# Altium schematic sheet Modem GNSS.SchDoc
size A2
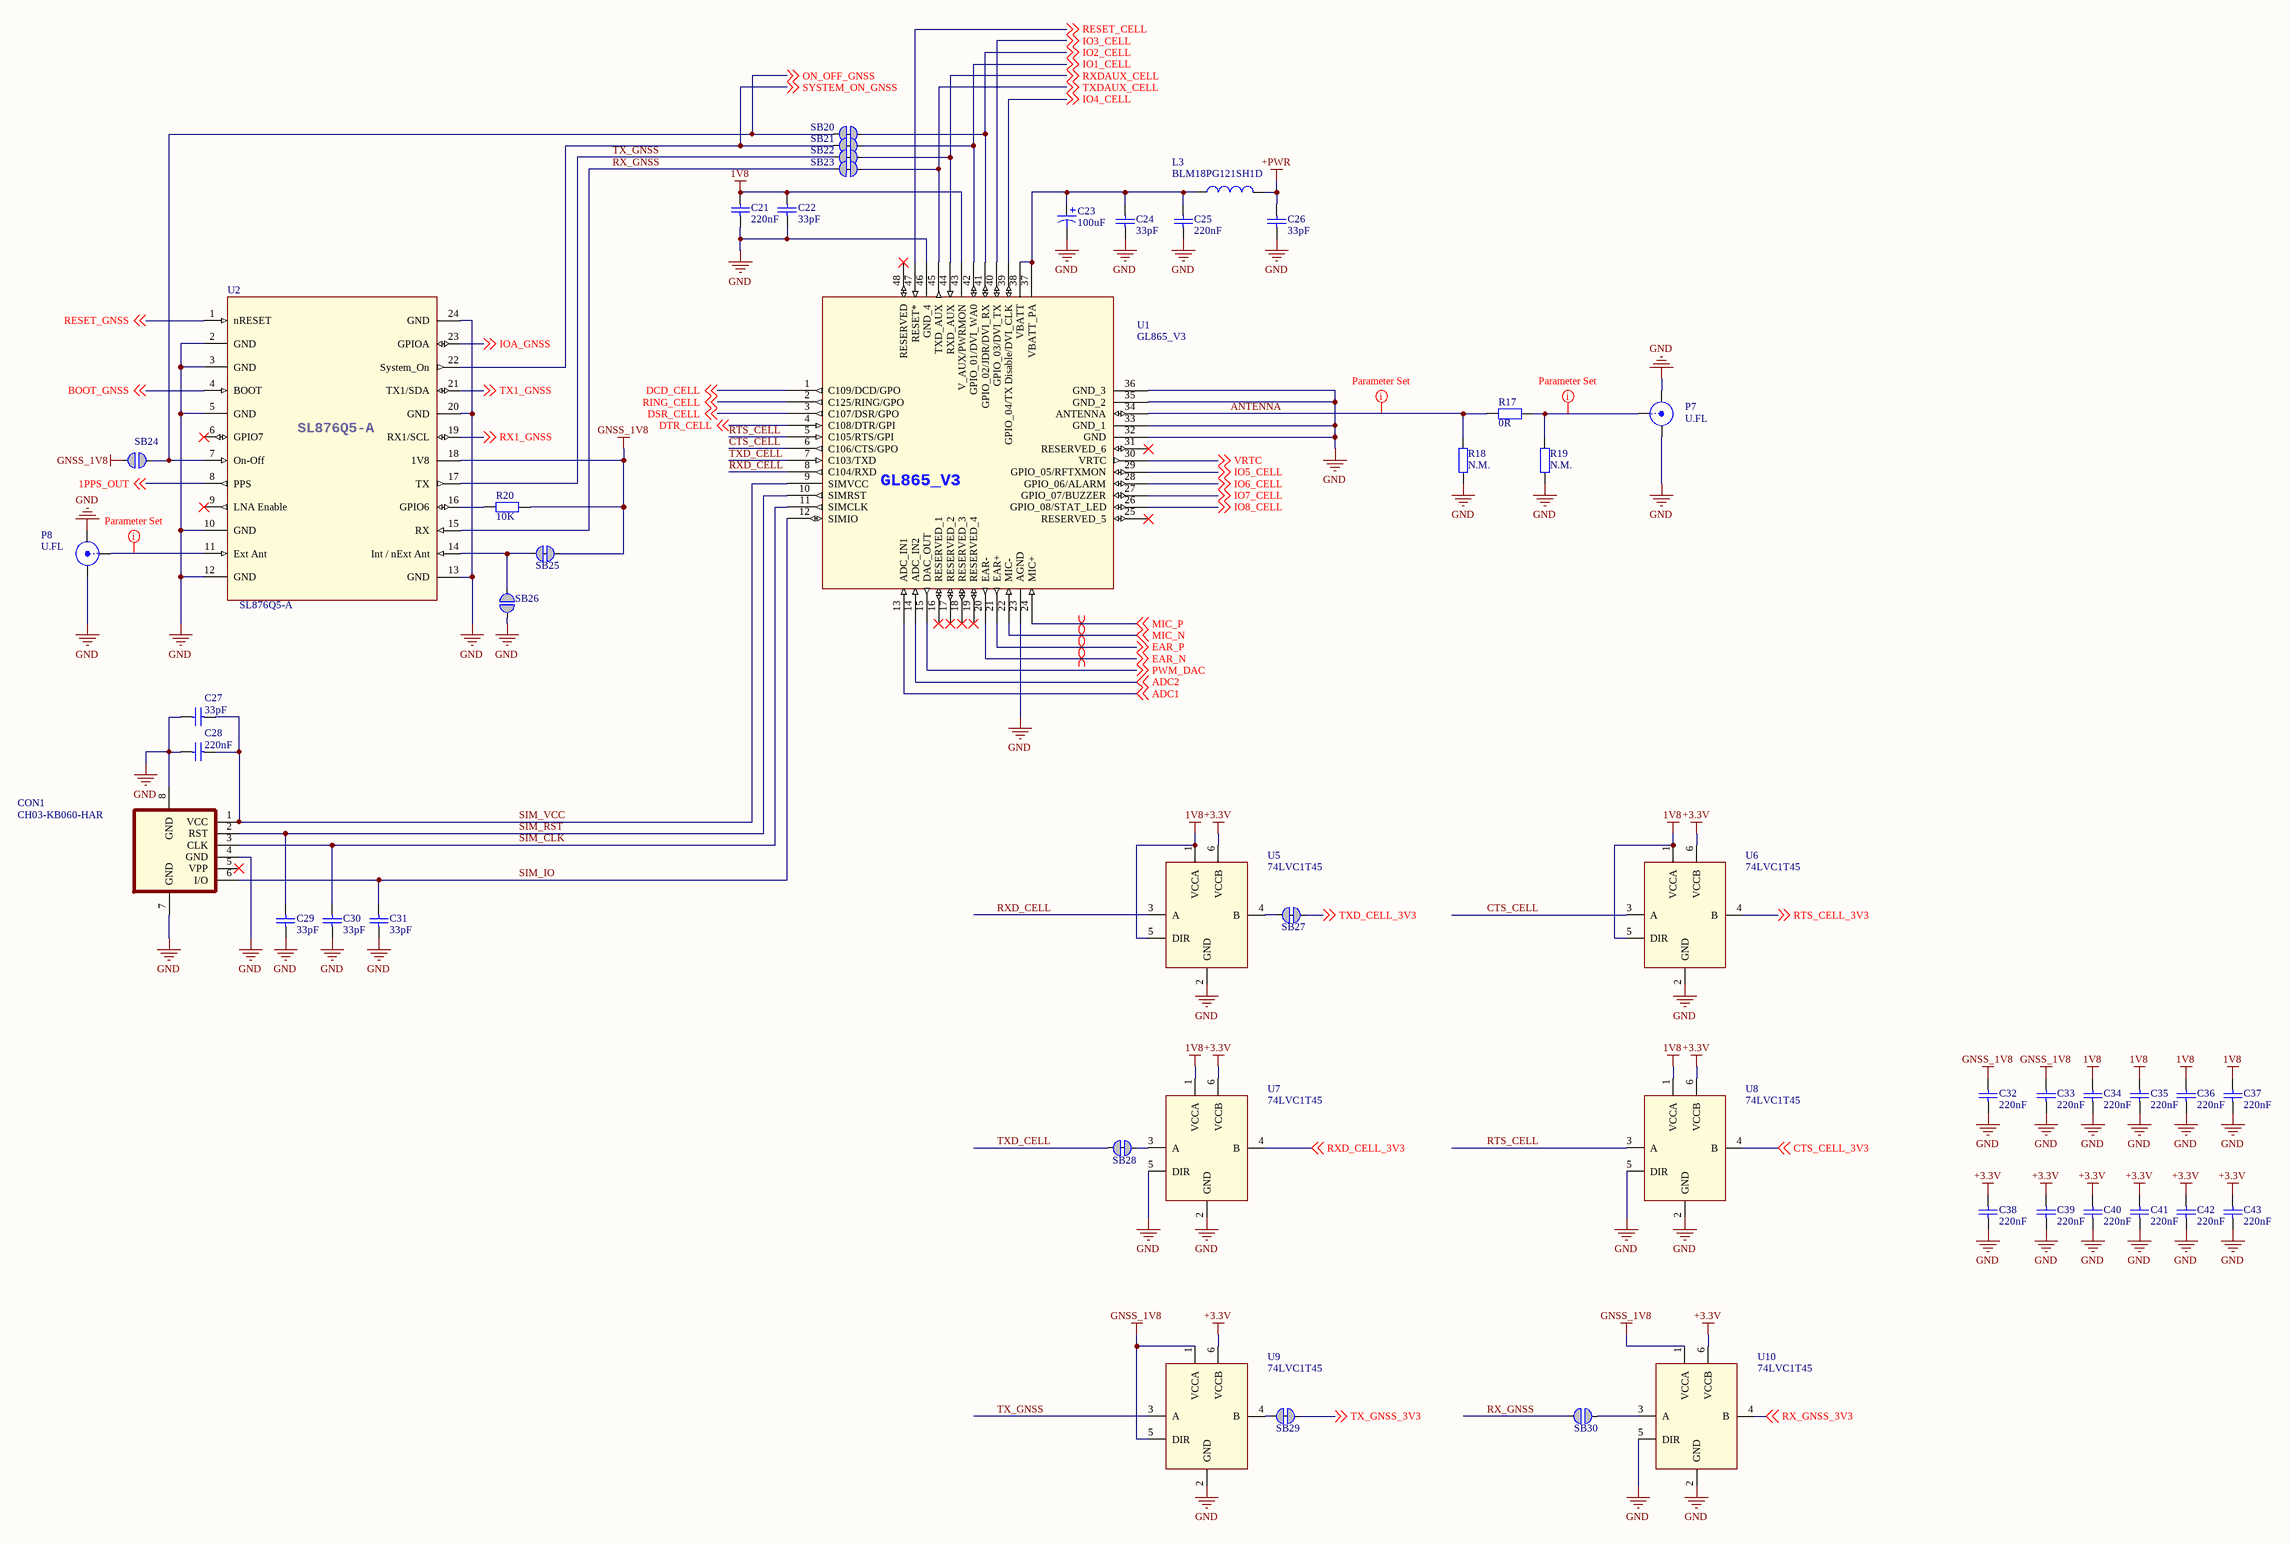
[diagram p0: Modem GNSS.SchDoc]

## Parts
C21  value 220nF  [C0402]  (hidden comment: Cap Semi)
C22  value 33pF  [C0402]  (hidden comment: Cap Semi)
C23  value 100uF  [Case-B]  (hidden comment: electrolytic capacitor)
C24  value 33pF  [C0402]  (hidden comment: Cap Semi)
C25  value 220nF  [C0402]  (hidden comment: Cap Semi)
C26  value 33pF  [C0402]  (hidden comment: Cap Semi)
C27  value 33pF  [C0402]  (hidden comment: Cap Semi)
C28  value 220nF  [C0402]  (hidden comment: Cap Semi)
C29  value 33pF  [C0402]  (hidden comment: Cap Semi)
C30  value 33pF  [C0402]  (hidden comment: Cap Semi)
C31  value 33pF  [C0402]  (hidden comment: Cap Semi)
C32  value 220nF  [C0402]  (hidden comment: Cap Semi)
C33  value 220nF  [C0402]  (hidden comment: Cap Semi)
C34  value 220nF  [C0402]  (hidden comment: Cap Semi)
C35  value 220nF  [C0402]  (hidden comment: Cap Semi)
C36  value 220nF  [C0402]  (hidden comment: Cap Semi)
C37  value 220nF  [C0402]  (hidden comment: Cap Semi)
C38  value 220nF  [C0402]  (hidden comment: Cap Semi)
C39  value 220nF  [C0402]  (hidden comment: Cap Semi)
C40  value 220nF  [C0402]  (hidden comment: Cap Semi)
C41  value 220nF  [C0402]  (hidden comment: Cap Semi)
C42  value 220nF  [C0402]  (hidden comment: Cap Semi)
C43  value 220nF  [C0402]  (hidden comment: Cap Semi)
CON1  CH03-KB060-HAR  [CH03-KB]
L3  value BLM18PG121SH1D  [L0603]  (hidden comment: Inductor)
P7  U.FL  [U.FL_Connector_Male]
P8  U.FL  [U.FL_Connector_Male]
R17  value 0R  [R0402]  (hidden comment: Res2)
R18  value N.M.  [R0402]  (hidden comment: Res2)  (no BOM)
R19  value N.M.  [R0402]  (hidden comment: Res2)  (no BOM)
R20  value 10K  [R0402]  (hidden comment: Res2)
SB20  Solderbridge  [Solderbridge_Shorted]  (value not drawn)  (net tie, no BOM)
SB21  Solderbridge  [Solderbridge_Shorted]  (value not drawn)  (net tie, no BOM)
SB22  Solderbridge  [Solderbridge_Shorted]  (value not drawn)  (net tie, no BOM)
SB23  Solderbridge  [Solderbridge_Shorted]  (value not drawn)  (net tie, no BOM)
SB24  Solderbridge  [Solderbridge]  (value not drawn)  (no BOM)
SB25  Solderbridge  [Solderbridge_Shorted]  (value not drawn)  (net tie, no BOM)
SB26  Solderbridge  [Solderbridge]  (value not drawn)  (no BOM)
SB27  Solderbridge  [Solderbridge_Shorted]  (value not drawn)  (net tie, no BOM)
SB28  Solderbridge  [Solderbridge_Shorted]  (value not drawn)  (net tie, no BOM)
SB29  Solderbridge  [Solderbridge_Shorted]  (value not drawn)  (net tie, no BOM)
SB30  Solderbridge  [Solderbridge]  (value not drawn)  (no BOM)
U1  GL865_V3  [XL865XXX]
U2  SL876Q5-A  [SL876Q5-A]
U5  74LVC1T45  [X2-DFN1410-6]
U6  74LVC1T45  [X2-DFN1410-6]
U7  74LVC1T45  [X2-DFN1410-6]
U8  74LVC1T45  [X2-DFN1410-6]
U9  74LVC1T45  [X2-DFN1410-6]
U10  74LVC1T45  [X2-DFN1410-6]

## Nets
1V8: C21.2 C22.2 C34.1 C35.1 C36.1 C37.1 U1.43(V_AUX/PWRMON) U5.1(VCCA) U5.5(DIR) U6.1(VCCA) U6.5(DIR) U7.1(VCCA) U8.1(VCCA)
+3.3V: C38.1 C39.1 C40.1 C41.1 C42.1 C43.1 U5.6(VCCB) U6.6(VCCB) U7.6(VCCB) U8.6(VCCB) U9.6(VCCB) U10.6(VCCB)
+PWR: C26.2 L3.2
GND: C21.1 C22.1 C23.2 C24.1 C25.1 C26.1 C27.2 C28.2 C29.2 C30.2 C31.2 C32.2 C33.2 C34.2 C35.2 C36.2 C37.2 C38.2 C39.2 C40.2 C41.2 C42.2 C43.2 CON1.4(GND) CON1.7(GND) CON1.8(GND) P7.2(Y) P7.3(Y) P8.2(Y) P8.3(Y) R18.2 R19.2 SB26.1 U1.23(AGND) U1.32(GND) U1.33(GND_1) U1.35(GND_2) U1.36(GND_3) U1.46(GND_4) U2.2(GND) U2.3(GND) U2.5(GND) U2.10(GND) U2.12(GND) U2.13(GND) U2.20(GND) U2.24(GND) U5.2(GND) U6.2(GND) U7.2(GND) U7.5(DIR) U8.2(GND) U8.5(DIR) U9.2(GND) U10.2(GND) U10.5(DIR)
GNSS_1V8: C32.1 C33.1 R20.2 SB24.2 SB25.1 U2.18(1V8) U9.1(VCCA) U9.5(DIR) U10.1(VCCA)
1PPS_OUT: U2.8(PPS) ; off-sheet 1PPS_OUT
ADC1: U1.13(ADC_IN1) ; off-sheet ADC1
ADC2: U1.14(ADC_IN2) ; off-sheet ADC2
ANTENNA: R17.2 R18.1 U1.34(ANTENNA)
BOOT_GNSS: U2.4(BOOT) ; off-sheet BOOT_GNSS
CTS_CELL: U1.6(C106/CTS/GPO) U6.3(A)
CTS_CELL_3V3: U8.4(B) ; off-sheet CTS_CELL_3V3
DCD_CELL: U1.1(C109/DCD/GPO) ; off-sheet DCD_CELL
DSR_CELL: U1.3(C107/DSR/GPO) ; off-sheet DSR_CELL
DTR_CELL: U1.4(C108/DTR/GPI) ; off-sheet DTR_CELL
EAR_N: U1.20(EAR-) ; off-sheet EAR_N
EAR_P: U1.21(EAR+) ; off-sheet EAR_P
IO1_CELL: SB21.1 U1.42(GPIO_01/DVI_WA0) ; off-sheet IO1_CELL
IO2_CELL: SB20.1 U1.41(GPIO_02/JDR/DVI_RX) ; off-sheet IO2_CELL
IO3_CELL: U1.40(GPIO_03/DVI_TX) ; off-sheet IO3_CELL
IO4_CELL: U1.39(GPIO_04/TX_Disable/DVI_CLK) ; off-sheet IO4_CELL
IO5_CELL: U1.29(GPIO_05/RFTXMON) ; off-sheet IO5_CELL
IO6_CELL: U1.28(GPIO_06/ALARM) ; off-sheet IO6_CELL
IO7_CELL: U1.27(GPIO_07/BUZZER) ; off-sheet IO7_CELL
IO8_CELL: U1.26(GPIO_08/STAT_LED) ; off-sheet IO8_CELL
IOA_GNSS: U2.23(GPIOA) ; off-sheet IOA_GNSS
MIC_N: U1.22(MIC-) ; off-sheet MIC_N
MIC_P: U1.24(MIC+) ; off-sheet MIC_P
ON_OFF_GNSS: SB20.2 SB24.1 U2.7(On-Off) ; off-sheet ON_OFF_GNSS
PWM_DAC: U1.15(DAC_OUT) ; off-sheet PWM_DAC
RESET_CELL: U1.47(RESET*) ; off-sheet RESET_CELL
RESET_GNSS: U2.1(nRESET) ; off-sheet RESET_GNSS
RING_CELL: U1.2(C125/RING/GPO) ; off-sheet RING_CELL
RTS_CELL: U1.5(C105/RTS/GPI) U8.3(A)
RTS_CELL_3V3: U6.4(B) ; off-sheet RTS_CELL_3V3
RX1_GNSS: U2.19(RX1/SCL) ; off-sheet RX1_GNSS
RX_GNSS: SB23.2 SB30.2 U2.15(RX)
RX_GNSS_3V3: U10.4(B) ; off-sheet RX_GNSS_3V3
RXD_CELL: U1.8(C104/RXD) U5.3(A)
RXD_CELL_3V3: U7.4(B) ; off-sheet RXD_CELL_3V3
RXDAUX_CELL: SB22.1 U1.44(RXD_AUX) ; off-sheet RXDAUX_CELL
SIM_CLK: C30.1 CON1.3(CLK) U1.11(SIMCLK)
SIM_IO: C31.1 CON1.6(I/O) U1.12(SIMIO)
SIM_RST: C29.1 CON1.2(RST) U1.10(SIMRST)
SIM_VCC: C27.1 C28.1 CON1.1(VCC) U1.9(SIMVCC)
SYSTEM_ON_GNSS: SB21.2 U2.22(System_On) ; off-sheet SYSTEM_ON_GNSS
TX1_GNSS: U2.21(TX1/SDA) ; off-sheet TX1_GNSS
TX_GNSS: SB22.2 U2.17(TX) U9.3(A)
TX_GNSS_3V3: SB29.2 ; off-sheet TX_GNSS_3V3
TXD_CELL: SB28.1 U1.7(C103/TXD)
TXD_CELL_3V3: SB27.1 ; off-sheet TXD_CELL_3V3
TXDAUX_CELL: SB23.1 U1.45(TXD_AUX) ; off-sheet TXDAUX_CELL
VRTC: U1.30(VRTC) ; off-sheet VRTC
NetC23_1: C23.1 C24.2 C25.2 L3.1 U1.37(VBATT_PA) U1.38(VBATT)
NetP7_1: P7.1(X) R17.1 R19.1
NetP8_1: P8.1(X) U2.11(Ext_Ant)
NetR20_1: R20.1 U2.16(GPIO6)
NetSB25_2: SB25.2 SB26.2 U2.14(Int_/_nExt_Ant)
NetSB27_2: SB27.2 U5.4(B)
NetSB28_2: SB28.2 U7.3(A)
NetSB29_1: SB29.1 U9.4(B)
NetSB30_1: SB30.1 U10.3(A)

Not connected (* = marked no-connect by the designer): CON1 5(VPP)*; U1 16(RESERVED_1)* 17(RESERVED_2)* 18(RESERVED_3)* 19(RESERVED_4)* 25(RESERVED_5)* 31(RESERVED_6)* 48(RESERVED)*; U2 6(GPIO7)* 9(LNA_Enable)*

## Layout directives
rule Clearance Constraint [Clearance = 0.2mm]; rule Width Constraint [Pref Width = 1.1mm    Min Width = 0.2mm    Max Width = 4mm]: ANTENNA, NetP7_1, NetP8_1
differential pair: EAR_N, EAR_P, MIC_N, MIC_P

## Library data of the parts
C21 C25 C28 C32-C43 = Cap Semi: Capacitor (Semiconductor SIM Model); Manufacturer: YAGEO; Manufacturer Part No.: CC0402KRX5R5BB224; Part Description: Ceramic Capacitor; Specification: X5R, 6.3V, 10%; Supplier: Rutronik; Supplier part number: KKK23148; Link: https://www.rutronik24.com/product/yageo/cc0402krx5r5bb224/3611951.html
C22 C24 C26 C27 C29-C31 = Cap Semi: Capacitor (Semiconductor SIM Model); Manufacturer: AVX; Manufacturer Part No.: 04025A330JAT2A; Part Description: Ceramic Capacitor; Specification: NP0, 6.3V, 5%; Supplier: Rutronik; Supplier part number: KKK13594; Link: https://www.rutronik24.com/product/avx/04025a330jat2a/3692730.html
C23 = Cap Pol1: Manufacturer: AVX; Manufacturer Part No.: TPSB107K006R0400; Part Description: Tantalum Capacitor; Specification: 6,3V 20%; Supplier: Rutronik; Supplier part number: KTA5959; Link: https://www.rutronik24.com/product/avx/tpsb107k006r0400/3688840.html
CON1 = CH03-KB060-HAR: Nano SIM Card Connector; Manufacturer: GradConn; Specification: Nano, 6 pins; Manufacturer Part No.: CH03-KB060-HAR; Supplier: Rutronik; Supplier part number: SIMCRD1002; Value: CH03-KB060-HAR; Part Description: Nano SIM Card Connector; Link: https://www.rutronik24.com/product/gradconn/ch03-kb060-har/7026333.html
L3 = Inductor: Manufacturer: muRata; Part Description: Ferrite Bead; Specification: 120R, 2A; Manufacturer Part No.: BLM18PG121SH1D; Supplier: Rutronik; Supplier part number: FE3867; Link: https://www.rutronik24.com/product/murata/blm18pg121sh1d/5885588.html
P7 P8 = SMB: Manufacturer: HIROSE; Manufacturer Part No.: U.FL-R-SMT-1(10); Part Description: U.FL Connector; Specification: Male; Value: U.FL-R-SMT-1(10); Supplier: Rutronik; Supplier part number: COREC23028; Link: https://www.hirose.com/product/en/products/U.FL/U.FL-R-SMT-1%2810%29/
R17-R19 = Res2: Manufacturer: YAGEO; Manufacturer Part No.: RC0402FR-070RL; Part Description: Thick Film Resistor; Specification: 5% 0,063W; Supplier: Rutronik; Supplier part number: WRC53079; Link: https://www.rutronik24.com/product/yageo/rc0402fr-070rl/5183530.html
R20 = Res2: Manufacturer: ASJ; Manufacturer Part No.: CR10-103-JK; Part Description: Thick Film Resistor; Specification: 5% 0,063W; Supplier: Rutronik; Supplier part number: WRC40976; Link: https://www.rutronik24.com/product/asj/cr10-103-jk/54295.html
SB20-SB23 SB25 SB27-SB29 = Solderbridge Shorted: Manufacturer: *; Value: Solderbridge; Supplier: *; Supplier part number: *
U1 = GL865_V3: Manufacturer: Telit; Manufacturer Part No.: GL865-DUAL V3.1; Part Description: Cellular Module; Specification: Dual  Band; Value: GL865-DUAL V3.1; Supplier: Rutronik; Supplier part number: GSM1755; Link: https://www.rutronik24.com/product/telit/gl865d31613t001/9566944.html
U2 = SL876Q5-A: Manufacturer: Telit; Part Description: GNSS Embedded Module; Specification: GPS, Glonass; Manufacturer Part No.: SL876Q5-A; Supplier: Rutronik; Supplier part number: GPS1354; Value: SL876Q5-A; Link: https://www.rutronik24.com/product/telit/sl876q5a001t001000/9723106.html
U5-U10 = 74LVC1T45: Manufacturer: Diodes Inc.; Manufacturer Part No.: 74LVC1T45FZ4-7; Part Description: Single Bit Voltage Level Translator; Specification: 5.5V, 1.65V; Value: 74LVC1T45FZ4-7; Supplier: Rutronik; Supplier part number: 74LVC1T45FZ4-7; Link: https://www.rutronik24.com/product/diodes+inc/74lvc1t45w6-7/7622634.html
SB24 SB26 SB30 = Solderbridge: Manufacturer: *; Value: Solderbridge; Supplier: *; Supplier part number: *